# EAGLE design schematic (EAGLE 9.5.2)
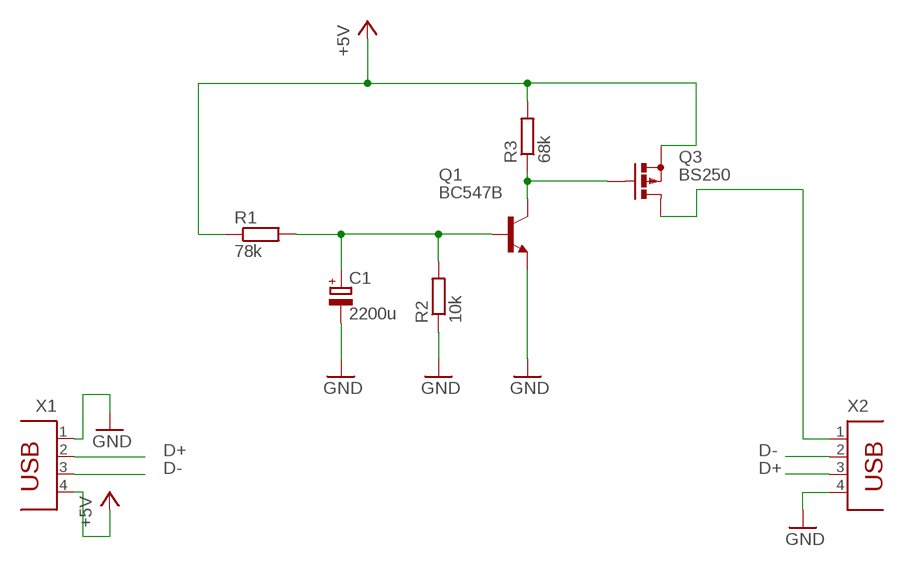
[diagram p0: schematic, sheet 1]

## Parts
C1  2200u  CPOL-EUE3.5-8  [E3,5-8]
Q1  BC547B  [TO92]
Q3  BS250  [SOT54E]
R1  78k  R-EU_0204/5  [0204/5]
R2  10k  R-EU_0204/5  [0204/5]
R3  68k  R-EU_0204/5  [0204/5]
X1  PN87520  [PN87520]
X2  PN87520  [PN87520]

## Nets
+5V: Q3.S R1.1 R3.2 X1.4
D+: X1.2 X2.3
D-: X1.3 X2.2
GND: C1.- Q1.1(E) R2.1 X1.1 X2.4
N$3: C1.+ Q1.2(B) R1.2 R2.2
N$4: Q1.3(C) Q3.G R3.1
N$5: Q3.D X2.1

## Library data of the parts
C1 = rcl:CPOL-EU: POLARIZED CAPACITOR, European symbol; SPICEPREFIX: C
Q1 = transistor-npn:BC547*: NPN Transistor
Q3 = transistor-small-signal:BS250: P-CHANNEL MOS FET
R1-R3 = rcl:R-EU_: RESISTOR, European symbol; SPICEPREFIX: R
X1 X2 = con-berg:PN87520: BERG USB connector; OC_FARNELL: unknown; OC_NEWARK: unknown

## Board
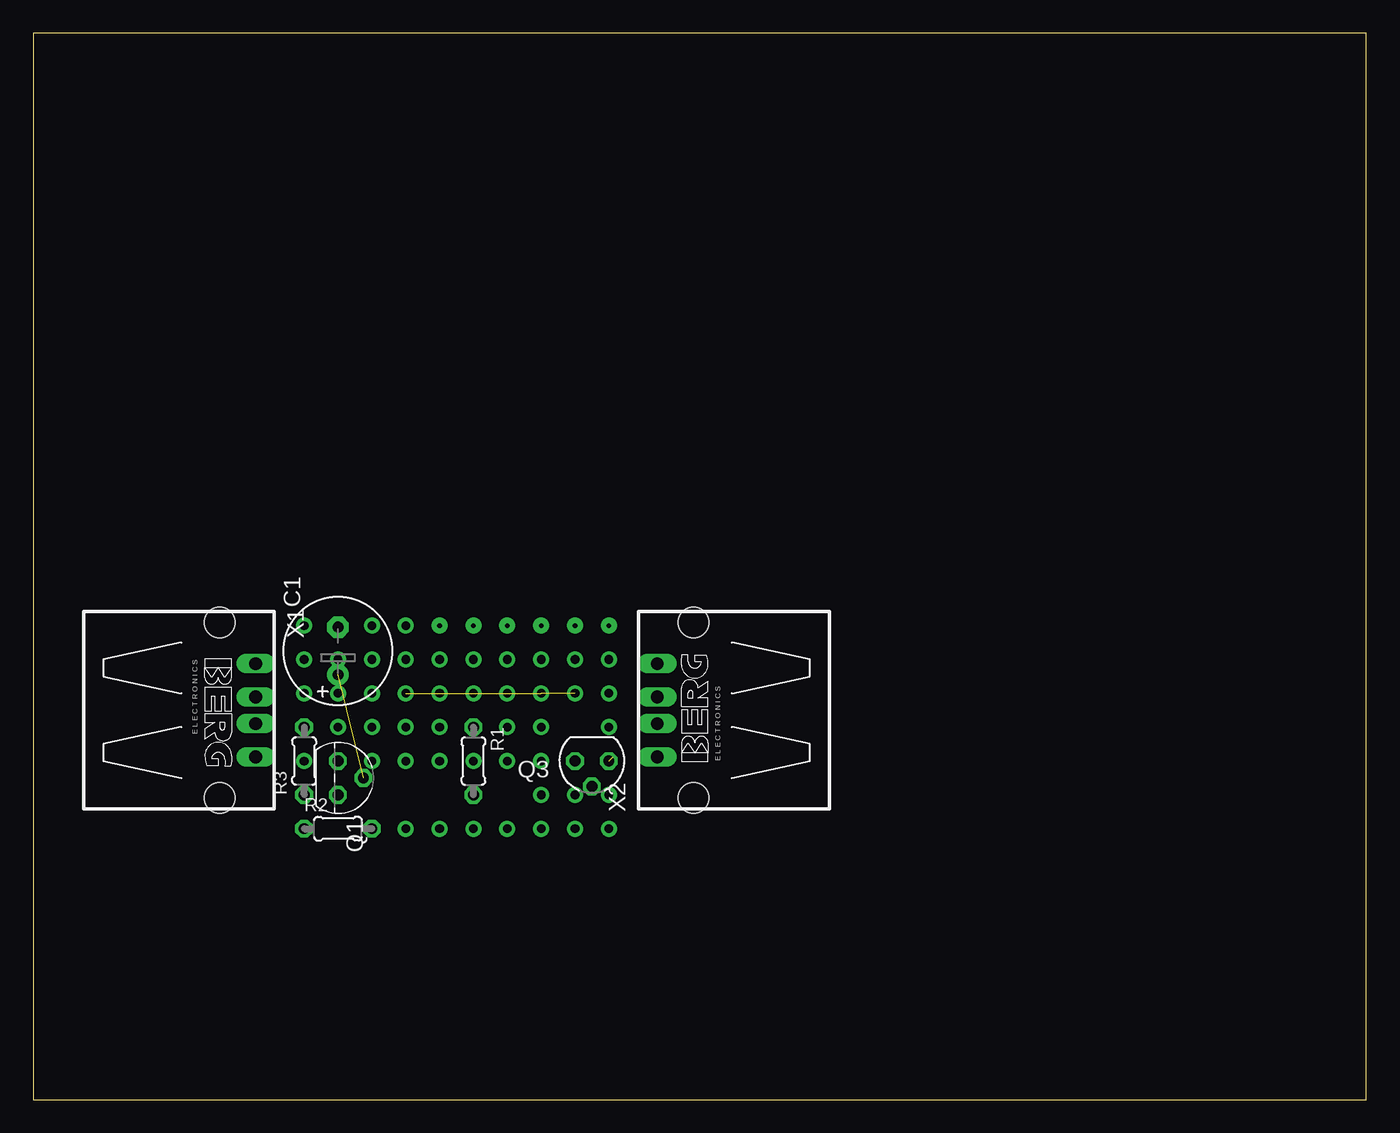
[diagram p1: board, top side]
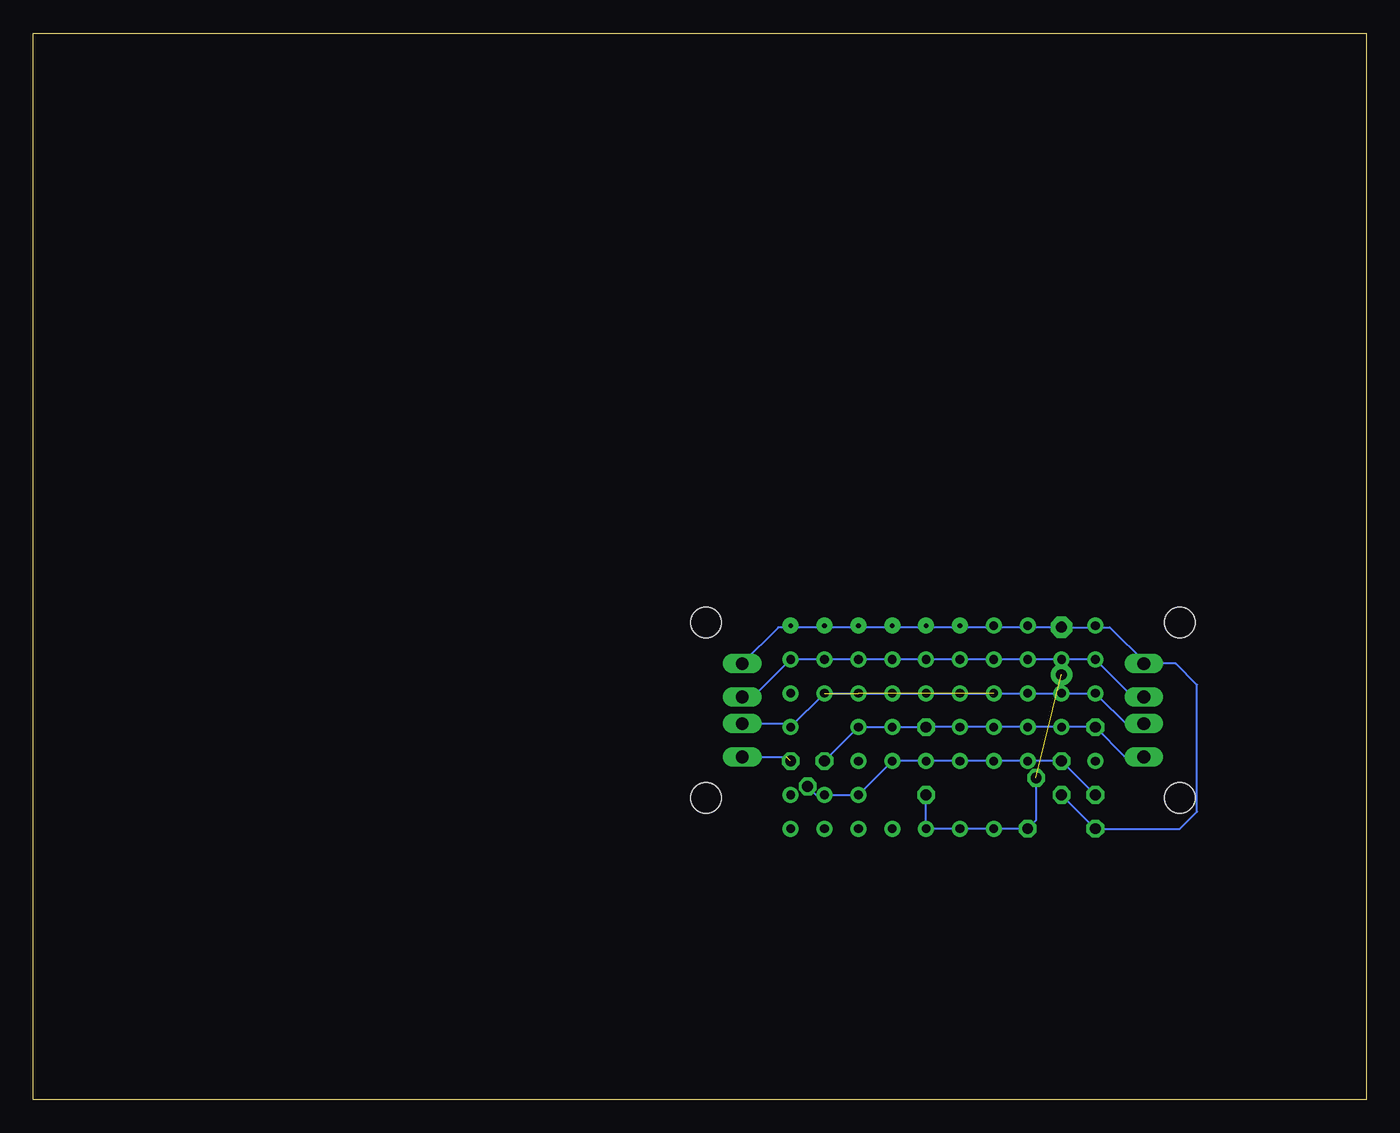
[diagram p2: board, bottom side, seen from below]

Size 100 x 80 mm. Coordinates in mm from the lower left corner, seen from the top.
Outline: 0,0 100,0 100,80 0,80 0,0
Copper layers (1*16): Top 0.035mm / dielectric 1.5mm / Bottom 0.035mm
Design rules "default": minimum track width 6mil, minimum drill 0.35mm, track to track 6mil, track to pad 6mil, pad to pad 6mil, via to via 6mil, smd to smd 6mil, copper to edge 40mil, drill to drill 6mil, minimum pad ring 10mil, minimum via ring 8mil, stop-mask expansion 4mil, vias tented up to drill 0mil, thermal gap 10mil

### Footprints (pad centres in the part's own frame; a part is rotated, then mirrored left to right if it is on the bottom)
E3,5-8 = drill 0.813 pad 1.6: + -1.778,0 | drill 0.813 pad 1.6 octagon: - 1.778,0
TO92 = drill 0.813 octagon: 1 1.27,0; 2 0,1.905; 3 -1.27,0
SOT54E = drill 0.813 octagon: D -1.27,0; G 0,1.905; S 1.27,0
0204/5 = drill 0.813 octagon: 1 -2.54,0; 2 2.54,0
PN87520 = drill 0.95 long: 1 -3.5,2.71; 2 -1,2.71; 3 1,2.71; 4 3.5,2.71 | hole 2.3: -6.57,0; 6.57,0

### Placement (x,y rotation side)
C1  22.86,33.66 90 top
Q1  22.86,24.13 270 top
Q3  41.91,25.4 180 top
R1  33.02,25.4 270 top
R2  22.86,20.32 0 top
R3  20.32,25.4 90 top
X1  13.97,29.21 270 top
X2  49.53,29.21 90 top

### Tracks (layer width: path | path; a pad name or v marks a point on that pad's centre or on a via)
+5V
  Bottom 0.152: X1.4 18.09,25.71 R3.2 R1.1 38.1,27.94 Q3.S
D+
  Bottom 0.152: X1.2 16.95,30.48 17.78,30.48 20.32,33.02 43.18,33.02 45.99,30.21 X2.3
D-  (via drill 0.65 pad 1.2)  (5 unrouted)
  Bottom 0.152: X2.2 43.45,28.21 43.18,27.94 v40.64,30.48 v25.4,30.48 20.32,30.48 17.78,27.94 16.95,27.94 X1.3
  other vias: 38.1,30.48 35.56,30.48 33.02,30.48 30.48,30.48 27.94,30.48
GND  (via drill 0.65 pad 1.2)
  Bottom 0.152: 16.51,32.71 14.29,32.71 12.7,31.11 12.7,21.59 13.97,20.32 R2.1 Q1.1 | 16.51,32.71 X1.1 | 16.51,32.71 19.23,35.43 C1.- 44.1,35.43 X2.4
  other vias: 20.32,20.32
N$1  (via drill 0.65 pad 1.2)
  other vias: 22.86,30.48
N$2  (via drill 0.65 pad 1.2)
  other vias: 30.48,20.32
N$3  (via drill 0.65 pad 1.2)  (1 unrouted)
  Bottom 0.152: R1.2 33.02,20.32 R2.2 24.77,20.95 Q1.2
  other vias: 33.02,22.86
N$4  (via drill 0.65 pad 1.2)
  Bottom 0.152: R3.1 Q1.3 v27.94,25.4 v30.48,25.4 35.56,25.4 v38.1,22.86 41.27,22.86 Q3.G
N$5  (1 unrouted)
  Bottom 0.152: X2.1 43.49,25.71
N$6  (via drill 0.65 pad 1.2)
  other vias: 33.02,20.32
N$13  (via drill 0.35 pad 1.2)
  other vias: 43.18,35.56
N$14  (via drill 0.35 pad 1.2)
  other vias: 40.64,35.56
N$15  (via drill 0.35 pad 1.2)
  other vias: 38.1,35.56
N$16  (via drill 0.35 pad 1.2)
  other vias: 35.56,35.56
N$17  (via drill 0.35 pad 1.2)
  other vias: 33.02,35.56
N$18  (via drill 0.35 pad 1.2)
  other vias: 30.48,35.56
N$19  (via drill 0.65 pad 1.2)
  other vias: 27.94,35.56
N$20  (via drill 0.65 pad 1.2)
  other vias: 25.4,35.56
N$21  (via drill 0.65 pad 1.2)
  other vias: 22.86,35.56
N$22  (via drill 0.65 pad 1.2)
  other vias: 22.86,33.02
N$23  (via drill 0.65 pad 1.2)
  other vias: 25.4,33.02
N$24  (via drill 0.65 pad 1.2)
  other vias: 27.94,33.02
N$25  (via drill 0.65 pad 1.2)
  other vias: 30.48,33.02
N$26  (via drill 0.65 pad 1.2)
  other vias: 33.02,33.02
N$27  (via drill 0.65 pad 1.2)
  other vias: 35.56,33.02
N$28  (via drill 0.65 pad 1.2)
  other vias: 38.1,33.02
N$29  (via drill 0.65 pad 1.2)
  other vias: 40.64,33.02
N$30  (via drill 0.65 pad 1.2)
  other vias: 43.18,33.02
N$31  (via drill 0.65 pad 1.2)
  other vias: 22.86,27.94
N$32  (via drill 0.65 pad 1.2)
  other vias: 25.4,27.94
N$33  (via drill 0.65 pad 1.2)
  other vias: 27.94,27.94
N$34  (via drill 0.65 pad 1.2)
  other vias: 30.48,27.94
N$35  (via drill 0.65 pad 1.2)
  other vias: 33.02,27.94
N$36  (via drill 0.65 pad 1.2)
  other vias: 35.56,27.94
N$37  (via drill 0.65 pad 1.2)
  other vias: 38.1,27.94
N$38  (via drill 0.65 pad 1.2)
  other vias: 43.18,27.94
N$39  (via drill 0.65 pad 1.2)
  other vias: 43.18,25.4
N$40  (via drill 0.65 pad 1.2)
  other vias: 38.1,25.4
N$41  (via drill 0.65 pad 1.2)
  other vias: 35.56,25.4
N$42  (via drill 0.65 pad 1.2)
  other vias: 33.02,25.4
N$43  (via drill 0.65 pad 1.2)
  other vias: 25.4,25.4
N$44  (via drill 0.65 pad 1.2)
  other vias: 22.86,25.4
N$45  (via drill 0.65 pad 1.2)
  other vias: 20.32,25.4
N$46  (via drill 0.65 pad 1.2)
  other vias: 20.32,27.94
N$47  (via drill 0.65 pad 1.2)
  other vias: 20.32,33.02
N$48  (via drill 0.65 pad 1.2)
  other vias: 20.32,35.56
N$50  (via drill 0.65 pad 1.2)
  other vias: 20.32,22.86
N$51  (via drill 0.65 pad 1.2)
  other vias: 22.86,22.86
N$57  (via drill 0.65 pad 1.2)
  other vias: 40.64,22.86
N$58  (via drill 0.65 pad 1.2)
  other vias: 43.18,22.86
N$59  (via drill 0.65 pad 1.2)
  other vias: 43.18,20.32
N$60  (via drill 0.65 pad 1.2)
  other vias: 40.64,20.32
N$61  (via drill 0.65 pad 1.2)
  other vias: 38.1,20.32
N$62  (via drill 0.65 pad 1.2)
  other vias: 35.56,20.32
N$63  (via drill 0.65 pad 1.2)
  other vias: 25.4,20.32
N$64  (via drill 0.65 pad 1.2)
  other vias: 27.94,20.32
N$65  (via drill 0.65 pad 1.2)
  other vias: 20.32,30.48
N$66  (via drill 0.65 pad 1.2)
  other vias: 43.18,30.48